# Altium schematic sheet HEATING_KAROFI.SchDoc
size A2; SheetNumber: 2; SheetTotal: 2
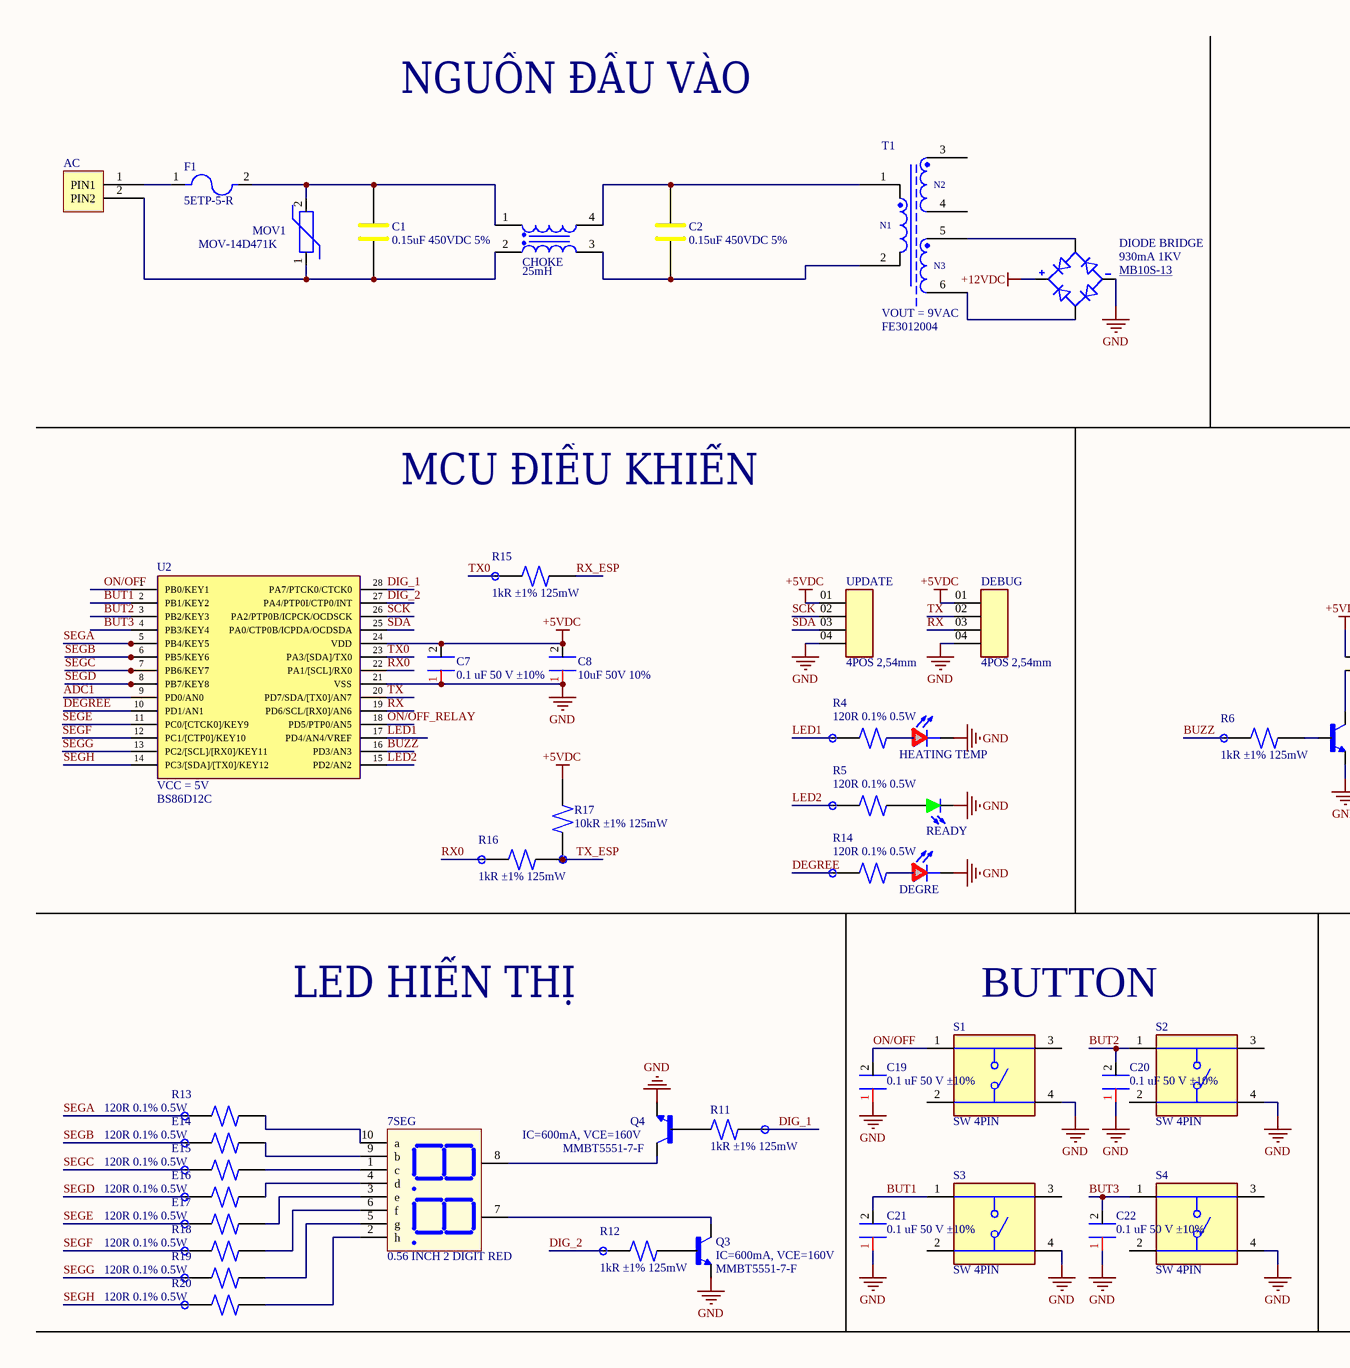
[diagram p0: HEATING_KAROFI.SchDoc, left]
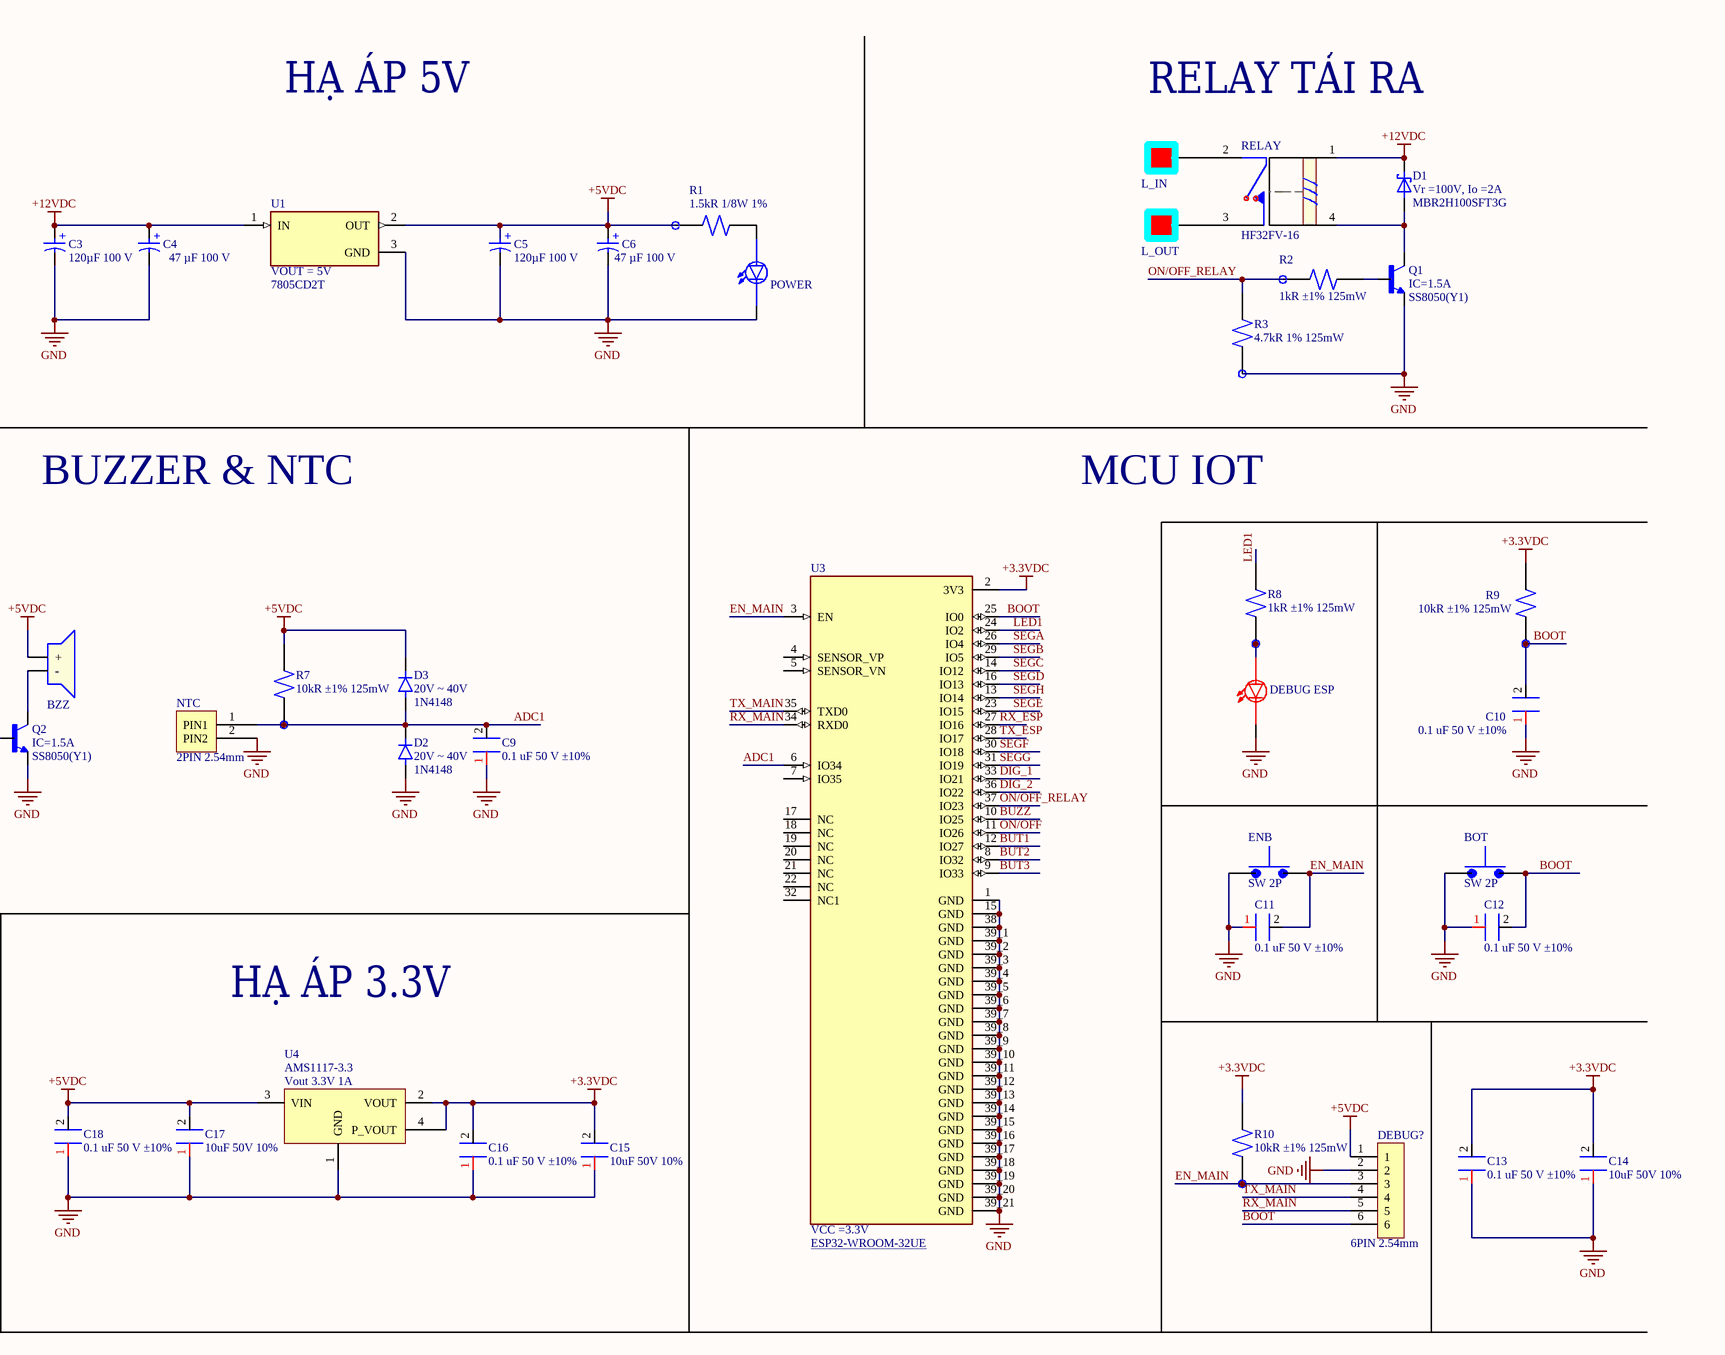
[diagram p1: HEATING_KAROFI.SchDoc, right]

## Parts
7SEG  value 0.56 INCH 2 DIGIT RED  [7SEG_K_2SO]  (hidden comment: CS5621A)
AC  2PIN 5.08mm  [HEADER_5.08mm]  (value not drawn)
BOT  SW 2P  [SW_BUTT-2PIN SMD SPST]
BZZ  BUZZERS;BUZZERS,5V,2400Hz,12x9.5mm,TMB12A05  [BUZZERS_TMB12A05]  (value not drawn)
C1  0.15uF 450VDC 5%  [CAP_FILM DIP 0.1uF 15x12x4mm]
C2  0.15uF 450VDC 5%  [CAP_FILM DIP 0.1uF 15x12x4mm]
C3  120µF 100 V  [CAP-ALUM_120uF-100V]
C4  47 µF 100 V  [CAP-ALUM_47uF-100V]
C5  120µF 100 V  [CAP-ALUM_120uF-100V]
C6  47 µF 100 V  [CAP-ALUM_47uF-100V]
C7  0.1 uF 50 V ±10%  [CAP-CER_0805 SMD 2.01x1.25mm]
C8  10uF 50V 10%  [CAP-CER_0805 SMD 2.01x1.25mm]
C9  0.1 uF 50 V ±10%  [CAP-CER_0805 SMD 2.01x1.25mm]
C10  0.1 uF 50 V ±10%  [CAP-CER_0805 SMD 2.01x1.25mm]
C11  0.1 uF 50 V ±10%  [CAP-CER_0805 SMD 2.01x1.25mm]
C12  0.1 uF 50 V ±10%  [CAP-CER_0805 SMD 2.01x1.25mm]
C13  0.1 uF 50 V ±10%  [CAP-CER_0805 SMD 2.01x1.25mm]
C14  10uF 50V 10%  [CAP-CER_0805 SMD 2.01x1.25mm]
C15  10uF 50V 10%  [CAP-CER_0805 SMD 2.01x1.25mm]
C16  0.1 uF 50 V ±10%  [CAP-CER_0805 SMD 2.01x1.25mm]
C17  10uF 50V 10%  [CAP-CER_0805 SMD 2.01x1.25mm]
C18  0.1 uF 50 V ±10%  [CAP-CER_0805 SMD 2.01x1.25mm]
C19  0.1 uF 50 V ±10%  [CAP-CER_0805 SMD 2.01x1.25mm]
C20  0.1 uF 50 V ±10%  [CAP-CER_0805 SMD 2.01x1.25mm]
C21  0.1 uF 50 V ±10%  [CAP-CER_0805 SMD 2.01x1.25mm]
C22  0.1 uF 50 V ±10%  [CAP-CER_0805 SMD 2.01x1.25mm]
CHOKE  25mH  [IND-CHOKE_25mH]
D1  Vr =100V, Io =2A  Manufacturer Part Number: MBR2H100SFT3G  [DIODE-SCHOTTKY_MBR2H100SFT3G-SOD123FL]
D2  20V ~ 40V  Manufacturer Part Number: 1N4148  [DIODE-SCHOTTKY_1N4148 5x2.4x1.2mm]
D3  20V ~ 40V  Manufacturer Part Number: 1N4148  [DIODE-SCHOTTKY_1N4148 5x2.4x1.2mm]
DEBUG  4POS 2,54mm  [JUMP_4POS_TH_NO-BODY]  (no BOM)
DEBUG?  6PIN 2.54mm  [HEADER_6PIN_2.54mm_NO-BODY]  (no BOM)
DEBUG_ESP  XL-1608SURC-06  [DIODE-LED_SMD-XL-1608SURC-06 RED 1.25x1.14mm]  (value not drawn)
DEGRE  LTL17KRH5D-012A  [LED_DIP_3mm; RED]  (value not drawn)
DIODE_BRIDGE  930mA 1KV  Manufacture Part Number Cross: MB10S-13  [DIODE-BRIDGE_MB10S_SOP4]
E14  120R 0.1% 0.5W  [RES_0805 2x1.25mm]
E15  120R 0.1% 0.5W  [RES_0805 2x1.25mm]
E16  120R 0.1% 0.5W  [RES_0805 2x1.25mm]
E17  120R 0.1% 0.5W  [RES_0805 2x1.25mm]
ENB  SW 2P  [SW_BUTT-2PIN SMD SPST]
F1  5ETP-5-R  [FUSE_5A-5ETP-5-R]
HEATING_TEMP  LTL17KRH5D-012A  [LED_DIP_3mm; RED]  (value not drawn)
L_IN  TP PCB  [TERMINAL]  (value not drawn)
L_OUT  TP PCB  [TERMINAL]  (value not drawn)
MOV1  MOV-14D471K  [VAR-MOV_14D561K]
NTC  2PIN 2.54mm  [HEADER-CONN_2POS_2.54mm]
POWER  LED BLUE  [DIODE-LED_SMD-LXT0805GW-TR 1.25X1.14MM]  (value not drawn)
Q1  IC=1.5A  Manufacturer Part Number: SS8050(Y1)  [TRANS-BJT_SS8050]
Q2  IC=1.5A  Manufacturer Part Number: SS8050(Y1)  [TRANS-BJT_SS8050]
Q3  IC=600mA, VCE=160V  Manufacture Part Number Cross: MMBT5551-7-F  [TRANS-BJT_SS8050]
Q4  IC=600mA, VCE=160V  Manufacture Part Number Cross: MMBT5551-7-F  [TRANS-BJT_SS8050]
R1  1.5kR 1/8W 1%  [RES_0805 2x1.25mm]
R2  1kR ±1% 125mW  [RES_0805 2x1.25mm]
R3  4.7kR 1% 125mW  [RES_0805 2x1.25mm]
R4  120R 0.1% 0.5W  [RES_0805 2x1.25mm]
R5  120R 0.1% 0.5W  [RES_0805 2x1.25mm]
R6  1kR ±1% 125mW  [RES_0805 2x1.25mm]
R7  10kR ±1% 125mW  [RES_0805 2x1.25mm]
R8  1kR ±1% 125mW  [RES_0805 2x1.25mm]
R9  10kR ±1% 125mW  [RES_0805 2x1.25mm]
R10  10kR ±1% 125mW  [RES_0805 2x1.25mm]
R11  1kR ±1% 125mW  [RES_0805 2x1.25mm]
R12  1kR ±1% 125mW  [RES_0805 2x1.25mm]
R13  120R 0.1% 0.5W  [RES_0805 2x1.25mm]
R14  120R 0.1% 0.5W  [RES_0805 2x1.25mm]
R15  1kR ±1% 125mW  [RES_0805 2x1.25mm]
R16  1kR ±1% 125mW  [RES_0805 2x1.25mm]
R17  10kR ±1% 125mW  [RES_0805 2x1.25mm]
R18  120R 0.1% 0.5W  [RES_0805 2x1.25mm]
R19  120R 0.1% 0.5W  [RES_0805 2x1.25mm]
R20  120R 0.1% 0.5W  [RES_0805 2x1.25mm]
READY  TLLG4400  [LED_DIP_3mm; GREEN]  (value not drawn)
RELAY  HF32FV-16  [RELAY 16A 4PIN]
S1  SW 4PIN  [SW_BUTT-4PIN-PLASTIC]
S2  SW 4PIN  [SW_BUTT-4PIN-PLASTIC]
S3  SW 4PIN  [SW_BUTT-4PIN-PLASTIC]
S4  SW 4PIN  [SW_BUTT-4PIN-PLASTIC]
T1  VOUT = 9VAC  Manufacturer Part Number: FE3012004  [FE3012-004]
U1  VOUT = 5V  Manufacture Part Number Cross: 7805CD2T  [IC_7805-TO220-3]
U2  VCC = 5V  Manufacture Cross: BS86D12C  [MCU-BS86D12C_SOP-28]
U3  VCC =3.3V  Manufacturer Part Number: ESP32-WROOM-32UE  [MCU_ESP32-WROOM-32UE]
U4  Vout 3.3V 1A  Manufacturer part Number: AMS1117-3.3  [IC_AMS1117-3.3V]
UPDATE  4POS 2,54mm  [JUMP_4POS_TH_NO-BODY]  (no BOM)

## Nets
+3.3VDC: C13.2 C14.2 C15.2 C16.2 R9.2 R10.2 U3.2(3V3) U4.2(VOUT) U4.4(P_VOUT)
+5VDC: BZZ.1(+) C5.1 C6.1 C7.2 C8.2 C17.2 C18.2 D3.K DEBUG.01 DEBUG?.1 R1.1 R7.2 R17.2 U1.2(OUT) U2.24(VDD) U4.3(VIN) UPDATE.01
+12VDC: C3.1 C4.1 D1.C DIODE_BRIDGE.1(POS) RELAY.1 U1.1(IN)
GND: BOT.1 C3.2 C4.2 C5.2 C6.2 C7.1 C8.1 C9.1 C10.1 C11.1 C12.1 C13.1 C14.1 C15.1 C16.1 C17.1 C18.1 C19.1 C20.1 C21.1 C22.1 D2.A DEBUG.04 DEBUG?.2 DEBUG_ESP.C DEGRE.2(C) DIODE_BRIDGE.2(NEG) ENB.1 HEATING_TEMP.2(C) NTC.2(PIN2) POWER.C Q1.2(E) Q2.2(E) Q3.2(E) Q4.2(E) R3.1 READY.K(C) S1.4 S2.4 S3.4 S4.4 U1.3(GND) U2.21(VSS) U3.1(GND) U3.15(GND) U3.38(GND) U3.39_1(GND) U3.39_2(GND) U3.39_3(GND) U3.39_4(GND) U3.39_5(GND) U3.39_6(GND) U3.39_7(GND) U3.39_8(GND) U3.39_9(GND) U3.39_10(GND) U3.39_11(GND) U3.39_12(GND) U3.39_13(GND) U3.39_14(GND) U3.39_15(GND) U3.39_16(GND) U3.39_17(GND) U3.39_18(GND) U3.39_19(GND) U3.39_20(GND) U3.39_21(GND) U4.1(GND) UPDATE.04
ADC1: C9.2 D2.K D3.A NTC.1(PIN1) R7.1 U2.9(PD0/AN0) U3.6(IO34)
BOOT: BOT.2 C10.2 C12.2 DEBUG?.6 R9.1 U3.25(IO0)
BUT1: C21.2 S3.1 U2.2(PB1/KEY2) U3.12(IO27)
BUT2: C20.2 S2.1 U2.3(PB2/KEY3) U3.8(IO32)
BUT3: C22.2 S4.1 U2.4(PB3/KEY4) U3.9(IO33)
BUZZ: R6.1 U2.16(PD3/AN3) U3.10(IO25)
DEGREE: R14.1 U2.10(PD1/AN1)
DIG_1: R11.1 U2.28(PA7/PTCK0/CTCK0) U3.33(IO21)
DIG_2: R12.1 U2.27(PA4/PTP0I/CTP0/INT) U3.36(IO22)
EN_MAIN: C11.2 DEBUG?.3 ENB.2 R10.1 U3.3(EN)
LED1: R4.1 R8.2 U2.17(PD4/AN4/VREF) U3.24(IO2)
LED2: R5.1 U2.15(PD2/AN2)
ON/OFF: C19.2 S1.1 U2.1(PB0/KEY1) U3.11(IO26)
ON/OFF_RELAY: R2.1 R3.2 U2.18(PD5/PTP0/AN5) U3.37(IO23)
RX: DEBUG.03 U2.19(PD6/SCL/[RX0]/AN6)
RX0: R16.1 U2.22(PA1/[SCL]/RX0)
RX_ESP: R15.2 U3.27(IO16)
RX_MAIN: DEBUG?.5 U3.34(RXD0)
SCK: U2.26(PA2/PTP0B/ICPCK/OCDSCK) UPDATE.02
SDA: U2.25(PA0/CTP0B/ICPDA/OCDSDA) UPDATE.03
SEGA: R13.1 U2.5(PB4/KEY5) U3.26(IO4)
SEGB: E14.1 U2.6(PB5/KEY6) U3.29(IO5)
SEGC: E15.1 U2.7(PB6/KEY7) U3.14(IO12)
SEGD: E16.1 U2.8(PB7/KEY8) U3.16(IO13)
SEGE: E17.1 U2.11(PC0/[CTCK0]/KEY9) U3.23(IO15)
SEGF: R18.1 U2.12(PC1/[CTP0]/KEY10) U3.30(IO18)
SEGG: R19.1 U2.13(PC2/[SCL]/[RX0]/KEY11) U3.31(IO19)
SEGH: R20.1 U2.14(PC3/[SDA]/[TX0]/KEY12) U3.13(IO14)
TX: DEBUG.02 U2.20(PD7/SDA/[TX0]/AN7)
TX0: R15.1 U2.23(PA3/[SDA]/TX0)
TX_ESP: R16.2 R17.1 U3.28(IO17)
TX_MAIN: DEBUG?.4 U3.35(TXD0)
Net7SEG_1: 7SEG.1(c) E15.2
Net7SEG_2: 7SEG.2(h) R20.2
Net7SEG_3: 7SEG.3(e) E17.2
Net7SEG_4: 7SEG.4(d) E16.2
Net7SEG_5: 7SEG.5(g) R19.2
Net7SEG_6: 7SEG.6(f) R18.2
Net7SEG_7: 7SEG.7(L2) Q3.3(C)
Net7SEG_8: 7SEG.8(Vcc) Q4.3(C)
Net7SEG_9: 7SEG.9(b) E14.2
Net7SEG_10: 7SEG.10(a) R13.2
NetAC_1: AC.1(PIN1) F1.1
NetAC_2: AC.2(PIN2) C1.1 CHOKE.2 MOV1.1
NetBZZ_2: BZZ.2(-) Q2.3(C)
NetC1_2: C1.2 CHOKE.1 F1.2 MOV1.2
NetC2_1: C2.1 CHOKE.3 T1.2
NetC2_2: C2.2 CHOKE.4 T1.1
NetD1_A: D1.A Q1.3(C) RELAY.4
NetDEBUG_ESP_A: DEBUG_ESP.A R8.1
NetDEGRE_1: DEGRE.1(A) R14.2
NetDIODE_BRIDGE_3: DIODE_BRIDGE.3(AC2) T1.6
NetDIODE_BRIDGE_4: DIODE_BRIDGE.4(AC1) T1.5
NetHEATING_TEMP_1: HEATING_TEMP.1(A) R4.2
NetL_IN_1: L_IN.1 RELAY.2
NetL_OUT_1: L_OUT.1 RELAY.3
NetPOWER_A: POWER.A R1.2
NetQ1_1: Q1.1(B) R2.2
NetQ2_1: Q2.1(B) R6.2
NetQ3_1: Q3.1(B) R12.2
NetQ4_1: Q4.1(B) R11.2
NetR5_2: R5.2 READY.A

Not connected (* = marked no-connect by the designer): S1 2 3; S2 2 3; S3 2 3; S4 2 3; T1 3 4; U3 4(SENSOR_VP) 5(SENSOR_VN) 7(IO35) 17(NC) 18(NC) 19(NC) 20(NC) 21(NC) 22(NC) 32(NC1)

## Notes on the sheet
- NGUỒN ĐẦU VÀO
- HẠ ÁP 5V
- RELAY TẢI RA
- MCU ĐIỀU KHIỂN
- BUZZER & NTC
- MCU IOT
- LED HIỂN THỊ
- BUTTON
- HẠ ÁP 3.3V
- Lần
- Nội dung thay đổi
- Ngày
- Vật liệu:
- Khối lượng:
- Số lượng:
- Sheet:
- Tên bản vẽ:
- Mã LK bản vẽ:
- Thiết kế
- Kiểm tra
- Phê duyệt
- Tên sản phẩm:
- Đơn vị
- Mã sản phẩm:
- Phiên bản
- Tỷ lệ
- Trang
- MINH REUS
- (in symbol CAP_ALUM;47UF 20% 100V;TH) +
- (in symbol CAP_ALUM;120uF 20% 100V;TH) +
- (in symbol PCB_TRANSFORMER;6P TH;) N2; N1; N3

## Library data of the parts
7SEG = SEVEN_LED_DIP, 0.56INCH, K-COMOM, RED, 2 DIGIT: SEVEN_LED_DIP, 0.56INCH, K-COMOM, RED, 2 DIGIT;CS5621A; Manufacturer: CHANCE  ELECTRONIC; Manufacture Cross: Broadcom / Avago; Manufacture Part Number Cross: HDSP-521E; Library Make By: Minh Reus; Manufacturer Part Number: CS5621A; Link: http://www.smggc.com/page5?product_id=28; ComponentLink1Description: Link Cross; ComponentLink1URL: https://www.mouser.com/ProductDetail/Broadcom-Avago/HDSP-521E?qs=pQfy5%252BKCabIW5pTqWifotQ%3D%3D; ComponentLink2Description: Link Original; ComponentLink2URL: https://www.mouser.com/ProductDetail/Broadcom-Avago/HDSP-521E?qs=pQfy5%252BKCabIW5pTqWifotQ%3D%3D; ComponentLink3Description: Link Datasheet; ComponentLink3URL: https://www.mouser.com/datasheet/2/678/AV02_3586EN_2024_06_27-1828384.pdf; Package: TH; Price: 0.96 USD
AC = HEADER_2PIN;TH;5.08mm: Headers & Wire Housings 2 CKT 5.08MM KK HDR; Manufacturer: Molex; Link in VN: NA; Values: 2PIN 2.5 mm; Library Make By: Minh Reus; Manufacturer Part Number: 10-08-1022; Link: https://www.xonelec.com/mpn/xkb/x8821wvs029tsn; Package: TH; Manufacture Cross: Molex; Manufacture Part Number Cross: 10-08-1022; Price: 0.195 USD; ComponentLink1Description: Link Datasheet; ComponentLink1URL: https://www.molex.com/en-us/products/part-detail/10081022?display=pdf; ComponentLink2Description: Link Cross; ComponentLink2URL: https://www.mouser.com/ProductDetail/Molex/10-08-1022?qs=zPGVQsJz0CCM8qNbb3Gz6w%3D%3D; ComponentLink3Description: Link Original; ComponentLink3URL: https://www.mouser.com/ProductDetail/Molex/10-08-1022?qs=zPGVQsJz0CCM8qNbb3Gz6w%3D%3D
BOT ENB = SWITCH_BUTTON ;SMD;: Tactile Switches 3.9x2.9x2.0mm 160gf Packaging Temp 60oC; Manufacturer: Alps Alpine; Manufacture Part Number: SKRKAEE010; Value: NA; Library Make By: Minh Reus; Link: https://www.snapeda.com/parts/SKRPABE010/ALPS/view-part/?ref=snap; Package: None; Price: https://www.snapeda.com/parts/SKRPABE010/ALPS/view-part/?ref=eda; Manufacture Cross: Alps Alpine; Manufacture Part Number Cross: SKRKAEE010; ComponentLink1Description: Link Datasheet; ComponentLink1URL: https://www.mouser.vn/datasheet/2/15/SKRK-1110686.pdf; ComponentLink2Description: Link Original; ComponentLink2URL: https://www.mouser.vn/ProductDetail/Alps-Alpine/SKRKAEE010?qs=haWY0xvQGj%252BcIYZCNiEMZg%3D%3D; ComponentLink3Description: Link Cross; ComponentLink3URL: https://www.mouser.vn/ProductDetail/Alps-Alpine/SKRKAEE010?qs=haWY0xvQGj%252BcIYZCNiEMZg%3D%3D
BZZ = BUZZERS;BUZZERS,5V,2400Hz,12x9.5mm,TMB12A05: Manufacturer: YUEXIN; Current: 30mA; Name: BUZZERS_TMB12A05; Link: https://www.lcsc.com/product-detail/Buzzers_YUEXIN-TMB12A05_C781860.html; Price: non-available; Value: 5V; Temperature: 30℃~+85℃; Package: TH; Manufacturer Part Number: TMB12A05; ComponentLink1Description: Link Datasheet; ComponentLink1URL: https://www.lcsc.com/datasheet/lcsc_datasheet_2304140030_YUEXIN-TMB12A05_C781860.pdf; ComponentLink2Description: Link Cross; ComponentLink2URL: https://www.lcsc.com/product-detail/Buzzers_YUEXIN-TMB12A05_C781860.html; ComponentLink3Description: Link Original; ComponentLink3URL: https://www.lcsc.com/product-detail/Buzzers_YUEXIN-TMB12A05_C781860.html; Manufacture Cross: YUEXIN; Manufacture Part Number Cross: TMB12A05
C1 C2 = CAP_FILM;TH;0.15uF 450VDC 5%;: CAR FILM Polypropylene Film Capacitor ;TH; 0.1uF 275V ECW-FE2W154JA; Manufacturer: Panasonic Electronic Components; Library Make By: Minh Reus; Manufacturer Part Number: ECW-FE2W154JA; Manufacture Cross: Panasonic Electronic Components; Manufacture Part Number Cross: ECW-FE2W154JA; Link: https://www.digikey.com/en/products/detail/panasonic-electronic-components/ECW-FE2W154JA/5880948; Package: TH; Value: 0.15uF 450VDC 5%; ComponentLink1Description: Link Original; ComponentLink1URL: https://www.digikey.com/en/products/detail/panasonic-electronic-components/ECW-FE2W154JA/5880948; ComponentLink2Description: Link Cross; ComponentLink2URL: https://www.mouser.vn/ProductDetail/Panasonic/ECW-FE2W154JA?qs=wYonFgBYHKnr31EZHmFN1Q%3D%3D; ComponentLink3Description: Link Datasheet; ComponentLink3URL: https://www.mouser.vn/datasheet/2/315/ABD0000C202-947675.pdf; Price: 0.20847 USD
C3 C5 = CAP_ALUM;120uF 20% 100V;TH: 120 µF 100 V Aluminum Electrolytic Capacitors Radial, Can 10000 Hrs @ 105°C; Manufacturer Part Number: EEU-FS2A121; Manufacturer: Panasonic Electronic Components; Library Make By: Minh Reus; ComponentLink1Description: Link Original; ComponentLink1URL: https://www.digikey.in/en/products/detail/panasonic-electronic-components/EEU-FS2A121/9597032; ComponentLink2Description: Datasheet Link; ComponentLink2URL: https://www.digikey.in/en/products/detail/panasonic-electronic-components/EEU-FS2A121/9597032; Packaging: TH; Value: 120µF 100 V; Manufacture Cross: Panasonic Electronic Components; Manufacture Part Number Cross: EEU-FS2A121; Link: https://www.digikey.in/en/products/detail/panasonic-electronic-components/EEU-FS2A121/9597032; Price: 0.093 USD; ComponentLink3Description: Link Cross; ComponentLink3URL: https://www.digikey.in/en/products/detail/panasonic-electronic-components/EEU-FS2A121/9597032
C4 C6 = CAP_ALUM;47UF 20% 100V;TH: 47 µF 100 V Aluminum Electrolytic Capacitors Radial, Can 6000 Hrs @ 105°C; Manufacturer Part Number: EEU-FS2A470; Manufacturer: Panasonic Electronic Components; Library Make By: Minh Reus; ComponentLink1Description: Link Original; ComponentLink1URL: https://www.digikey.com/en/products/detail/panasonic-electronic-components/EEU-FS2A470/9597028; ComponentLink2Description: Datasheet Link; ComponentLink2URL: https://www.digikey.com/en/products/detail/panasonic-electronic-components/EEU-FS2A470/9597028; Packaging: TH; Value: 47 µF 100 V; Manufacture Cross: Panasonic Electronic Components; Manufacture Part Number Cross: EEU-FS2A470; Link: https://www.digikey.com/en/products/detail/panasonic-electronic-components/EEU-FS2A470/9597028; Price: 0.093 USD; ComponentLink3Description: Link Cross; ComponentLink3URL: https://www.digikey.com/en/products/detail/panasonic-electronic-components/EEU-FS2A470/9597028
C7 C9-C13 C16 C18-C22 = CAP_CER; SMD; 0.1uF 50V ±10%;0805;: Multilayer Ceramic Capacitor, 0.1 uF, 50 V, ± 10%, X7R, 0805 [2012 Metric]; Manufacturer: Kyocera AVX; Manufacturer Part Number: 08055C104K4T4A; Manufacture Cross: Vishay; Manufacture Part Number Cross: VJ0805Y104KBABE31; Library Make By: Minh Reus; Price: 0.0241 USD; Package: 0805; Value: 0.1uF 50V 10%; ComponentLink1URL: https://datasheet.ciiva.com/26904/getdatasheetpartid-74229-26904224.pdf?src-supplier=Verical; ComponentLink1Description: Link Datasheet; ComponentLink2URL: https://www.digikey.com/en/products/detail/kyocera-avx/08055C104K4T4A/1602855; ComponentLink2Description: Link Original; ComponentLink3URL: https://www.mouser.vn/ProductDetail/Vishay-Vitramon/VJ0805Y104KBABE31?qs=TLaLXeh6c70yB%252BsdRZoYCQ%3D%3D; ComponentLink3Description: Link Cross; Link: https://www.digikey.com/en/products/detail/kyocera-avx/08055C104K4T4A/1602855
C8 C14 C15 C17 = CAP_CER;10uF 50V 10%;SMD;0805: Ceramic Capacitor, Multilayer, Ceramic, 50V, 10% +Tol, 10% -Tol, X5R, 10uF, Surface Mount, 0805; Manufacturer: Murata; Manufacturer Part Number: GRM21BR61H106KE43K; Manufacture Cross: SANYEAR; Manufacture Part Number Cross: C0805X5R106K500NT; Library Make By: Minh Reus; Package: 0805; Value: 10uF 50V 10%; ComponentLink1URL: https://datasheet.octopart.com/GRM21BR61H106KE43K-Murata-datasheet-155239205.pdf?src-supplier=Newark; ComponentLink1Description: Link Datasheet; ComponentLink2URL: https://www.lcsc.com/product-detail/Multilayer-Ceramic-Capacitors-MLCC-SMD-SMT_SANYEAR-C0805X5R106K500NT_C962154.html; ComponentLink2Description: Link Cross; ComponentLink3URL: https://www.digikey.com/en/products/detail/murata-electronics/GRM21BR61H106KE43K/15191954; ComponentLink3Description: Link Original; Price: 0.0679 USD; Link: https://www.digikey.com/en/products/detail/murata-electronics/GRM21BR61H106KE43K/15191954
CHOKE = INDUCTOR_CHOKE;TH;25mH: WE-TFC THT Common Mode Power Line Choke, UU9.8V, 25mH, 0.25A, 3.6Ω; Manufacturer Part Number: 744862250; Value: 25 mH 10 kHz; ComponentLink1Description: Link Cross; ComponentLink1URL: https://www.we-online.com/redexpert/article/744862250?ad; ComponentLink2Description: Link Datasheet; ComponentLink2URL: https://www.we-online.com/redexpert/spec/744862250?ad; Manufacture Cross: WE-TFC; Manufacture Part Number Cross: 744862250; Manufacturer: WE-TFC; Price: 2.2 USD; Link: https://www.digikey.com/en/products/detail/w%C3%BCrth-elektronik/744862250/2626083; Packaging: Through Hole; ComponentLink3Description: Link Original; ComponentLink3URL: https://www.digikey.com/en/products/detail/w%C3%BCrth-elektronik/744862250/2626083
D1 = DIODE_SCHOTTKY;SMD;SOD-123FL;2A: Diode Schottky 100V 2A Surface Mount SOD-123FL; Manufacturer: ON Semiconductor; Manufacture Cross: Diodes Incorporated; Manufacture Part Number Cross: B2100-13-F; Value: NA; Library Make By: Minh Reus; Package: SOD-123 ON Semiconductor; Link: https://www.digikey.com/en/products/detail/onsemi/MBR2H100SFT3G/2194005; Price: 0.13994 USD; ComponentLink1Description: Link Datasheet; ComponentLink1URL: https://www.diodes.com/assets/Datasheets/ds30021.pdf; ComponentLink2Description: Link Original; ComponentLink2URL: https://www.digikey.com/en/products/detail/onsemi/MBR2H100SFT3G/2194005; ComponentLink3Description: Link Cross; ComponentLink3URL: https://www.digikey.com/en/products/detail/diodes-incorporated/B2100-13-F/814957
D2 D3 = DIODE_SCHOTTKY; SMD;: DIODE SCHOTTKY; SMD; VCC 20V-->40V; Manufacturer: CHENMKO ENTERPRISE; Manufacture Cross: Vishay Semiconductors; Manufacture Part Number Cross: BAT54WS-HE3-08; Library Make By: Minh Reus; Link: https://www.digchip.net/datasheets/parts/datasheet/882/LL340PT.php; Link in VN: https://linhkienchatluong.vn/diode-chinh-luu/diode-1n4148-sot-80-smd-loai-thuong-day-500c_sp572_ct8027.aspx; Package: SOT-80; Value: 20V ~ 40V; ComponentLink1Description: Link Datasheet; ComponentLink1URL: https://www.vishay.com/docs/85667/bat54ws.pdf; ComponentLink2Description: Link Cross; ComponentLink2URL: https://www.mouser.vn/ProductDetail/Vishay-Semiconductors/BAT54WS-HE3-08?qs=ESFF34Uzhwit1TO6n98Cjg%3D%3D&mgh=1&utm_id=21163026226&gad_source=1&gclid=Cj0KCQjwq_G1BhCSARIsACc7Nxq-ByYxpFlbPIIvX67EumUAu1MSEoCGJu52P8TCuTLh4yWmNT1_8AoaAmsOEALw_wcB; ComponentLink3Description: Link Original; ComponentLink3URL: https://www.digchip.net/datasheets/parts/datasheet/882/LL340PT.php; Price: 0.051 USD
DEBUG UPDATE = JUMP_4POS;TH;2.54;NO-BODY: CONN HEADER VERT 4POS 2.54MM; Manufacture: Samtec; Manufacture Part Number: HMTSW-104-08-S-S-280; Manufacture Part Number Cross: HMTSW-104-08-G-S-250; Value: NA; Library Make By: Minh Reus; Link: https://www.snapeda.com/parts/HMTSW-104-08-S-S-280/Samtec/view-part/?ref=snap; Package: TH; Manufacture Cross: Samtec; Price: 1.06 USD; ComponentLink1Description: Link Datasheet; ComponentLink1URL: https://www.digikey.com/en/products/detail/samtec-inc/HMTSW-104-08-G-S-250/8450805; ComponentLink2Description: Link Cross; ComponentLink2URL: https://www.digikey.com/en/products/detail/samtec-inc/HMTSW-104-08-G-S-250/8450805; ComponentLink3Description: Link Original; ComponentLink3URL: https://www.digikey.com/en/products/detail/samtec-inc/HMTSW-104-08-G-S-250/8450805
DEBUG? = HEADER_6PIN;TH;6PIN 2.54mm;NO-BODY: 6 Position Elevated Socket Connector 0.100" (2.54mm) Through Hole Gold; Manufacture: SAMTEC; Manufacture Part Number: ESQ-106-59-G-S; Value: NA; Library Make By: Minh Reus; Price: 2.71 USD; Link: https://www.digikey.com/en/products/detail/samtec-inc/ESQ-106-59-G-S/7097334; Package: TH; Manufacture Cross: SAMTEC; Manufacture Part Number Cross: ESQ-106-59-G-S; ComponentLink1Description: Link Datasheet; ComponentLink1URL: https://suddendocs.samtec.com/catalog_english/esq_th.pdf; ComponentLink2Description: Link Cross; ComponentLink2URL: https://www.digikey.com/en/products/detail/samtec-inc/ESQ-106-59-G-S/7097334; ComponentLink3Description: Link Original; ComponentLink3URL: https://www.digikey.com/en/products/detail/samtec-inc/ESQ-106-59-G-S/7097334
DEBUG_ESP = DIODE_LED;SMD;RED COLOUR: DIODE_LED;SMD;RED COLOUR; XL-1608SURC-06; / 25mA ; -30℃~+85℃ Positive post 617nm~621nm Red 120° 55mW 0805 Light Emitting Diodes (LED) ROHS; Manufacturer: XINGLIGHT; Manufacture Cross: Würth Elektronik; Manufacture Part Number Cross: 150080BS75000; Values: NA; Library Make By: Minh Reus; Manufacturer Part Number: XL-1608SURC-06; Link: https://www.lcsc.com/product-detail/Light-Emitting-Diodes-LED_XINGLIGHT-XL-1608SURC-06_C965799.html; Link in VN: NA; Package: SMD 0805; Price: 0.131 USD; ComponentLink1Description: New link; ComponentLink1URL: *; ComponentLink2Description: New link; ComponentLink2URL: *; ComponentLink3Description: New link; ComponentLink3URL: *
DEGRE HEATING_TEMP = LED_SINGLE_DIP; RED; 3mm_1: LED_SINGLE_DIP; RED; 3mm; Package: 3mm; Price: None; Value: *; Manufacturer Part Number: LTL17KRH5D-012A; Link: https://www.lcsc.com/product-detail/Light-Emitting-Diodes-span-style-background-color-ff0-LED-span_Lite-On-LTL17KRH5D-012A_C7435538.html
DIODE_BRIDGE = DIODE_BRIDGE;SMD;1KV 930mA: Bridge Rectifier Single Phase Standard 1 kV Surface Mount 4-SOIC; Manufacturer: ON Semiconductor; Manufacture Cross: Diodes Incorporated; Manufacturer Part Number: MB10S; Library Make By: Minh Reus; Value: 930mA 1kV; Price: 0.098 USD; Package: SOIC W-4 ON Semiconductor; Link: https://www.mouser.vn/ProductDetail/Diodes-Incorporated/MB10S-13?qs=5aG0NVq1C4wPZ2Ttiq0ONw%3D%3D&utm_id=10891671065&gad_source=1&gclid=Cj0KCQjwzva1BhD3ARIsADQuPnUE4S6tFXpZKEunPRtKt-VN8q0pn3n1xgvXIpo0Gd4DdVGxs75Bb50aAn4MEALw_wcB; ComponentLink1Description: Link Datasheet; ComponentLink1URL: https://www.mouser.vn/datasheet/2/115/DIOD_S_A0003097176_1-2542130.pdf; ComponentLink2Description: Link Cross; ComponentLink2URL: https://www.mouser.vn/ProductDetail/Diodes-Incorporated/MB10S-13?qs=5aG0NVq1C4wPZ2Ttiq0ONw%3D%3D&utm_id=10891671065&gad_source=1&gclid=Cj0KCQjwzva1BhD3ARIsADQuPnUE4S6tFXpZKEunPRtKt-VN8q0pn3n1xgvXIpo0Gd4DdVGxs75Bb50aAn4MEALw_wcB; ComponentLink3Description: Link Original; ComponentLink3URL: https://www.mouser.vn/ProductDetail/Diodes-Incorporated/MB10S-13?qs=5aG0NVq1C4wPZ2Ttiq0ONw%3D%3D&utm_id=10891671065&gad_source=1&gclid=Cj0KCQjwzva1BhD3ARIsADQuPnUE4S6tFXpZKEunPRtKt-VN8q0pn3n1xgvXIpo0Gd4DdVGxs75Bb50aAn4MEALw_wcB
E14-E17 R4 R5 R13 R14 R18-R20 = RES; SMD; 120R 0.1% 0.5W;0805: Thick Film Resistors 0805 120ohms 0.5W 0.5% AEC-Q200; Manufacturer Part Number: ERJ-P06D1200V; Manufacturer: Panasonic; Value: 120R 0.1% 1/10W; Library Make By: Minh Reus; Link: https://www.mouser.com/ProductDetail/Panasonic/ERJ-P06D1200V?qs=sGAEpiMZZMvdGkrng054tzSGWtpoOZZIMqKhr0RuMnQ%3D; Package: 0805; Manufacture Part Number Cross: ERJ-P06D1200V; Manufacture Cross: Panasonic; Price: 0.0333 USD; ComponentLink1Description: Link Cross; ComponentLink1URL: https://www.mouser.com/datasheet/2/315/AOA0000C331-1141874.pdf; ComponentLink2Description: Link Original; ComponentLink2URL: https://www.mouser.com/ProductDetail/Panasonic/ERJ-P06D1200V?qs=sGAEpiMZZMvdGkrng054tzSGWtpoOZZIMqKhr0RuMnQ%3D; ComponentLink3Description: Link Datasheet; ComponentLink3URL: https://www.mouser.com/ProductDetail/Panasonic/ERJ-P06D1200V?qs=sGAEpiMZZMvdGkrng054tzSGWtpoOZZIMqKhr0RuMnQ%3D
F1 = FUSE;TH;5A: FUSE;TH;5A;5ETP 1-R (0655R1000-13) | Glass Tube Fuse | 5x20mm | IEC Low Break | Time Lag | High Surge | 1A; Manufacturer: BEL FUSE; Library Make By: Minh Reus; Package: DIP; Value: 5A; Manufacturer Part Number: 5ETP-5-R; Link: https://www.digikey.com/en/products/detail/bel-fuse-inc/5ETP-5-R/2257992; Manufacture Cross: BEL FUSE; Manufacture Part Number Cross: 5ETP-5-R; Price: 0.292 USD; ComponentLink1Description: Link Datasheet; ComponentLink1URL: https://www.mouser.vn/datasheet/2/643/ds_CP_5et_5etp_series-1313106.pdf; ComponentLink2Description: Link Cross; ComponentLink2URL: https://www.mouser.vn/ProductDetail/Bel-Fuse/5ETP-5-R?qs=MvPYbBWWJysDCsdsmDMC5w%3D%3D&srsltid=AfmBOopbcfA4DgRyLok976fAHN5m2cGoLzSHNjZ65nxq0BfdXqxbc4a9; ComponentLink3Description: Link Original; ComponentLink3URL: https://www.mouser.vn/ProductDetail/Bel-Fuse/5ETP-5-R?qs=MvPYbBWWJysDCsdsmDMC5w%3D%3D&srsltid=AfmBOopbcfA4DgRyLok976fAHN5m2cGoLzSHNjZ65nxq0BfdXqxbc4a9
L_IN L_OUT = TERMINAL 220VAC;TH: Plugin PCB Welding Terminal ROHS; Manufacturer: TE Connectivity; Manufacturer Part Number: 63862-1; Value: NA; Manufacture Cross: TE Connectivity; Manufacture Part Number Cross: 63862-1; Link: https://www.lcsc.com/product-detail/PCB-Welding-Terminal_TE-Connectivity-63862-1_C573777.html; Price: 0.01 USD; Package: TH; Library Make By: NA; ComponentLink1Description: Link Cross; ComponentLink1URL: https://www.lcsc.com/product-detail/PCB-Welding-Terminal_TE-Connectivity-63862-1_C573777.html; ComponentLink2Description: Link Original; ComponentLink2URL: https://www.lcsc.com/product-detail/PCB-Welding-Terminal_TE-Connectivity-63862-1_C573777.html; ComponentLink3Description: Link Datasheet; ComponentLink3URL: https://www.lcsc.com/product-detail/PCB-Welding-Terminal_TE-Connectivity-63862-1_C573777.html
MOV1 = VAR_MOV;DIP;14D471K: 561kV 4.5 kA Varistor 1 Circuit Through; -55° C to + 125° C; Manufacturer Part Number: MOV-14D561K; Manufacturer: Bourns; Library Make By: Minh Reus; Package: Disc-14 Bourns; Link: https://www.mouser.vn/ProductDetail/Bourns/MOV-14D561K?qs=CQ3B1E%252BbPs3fNJrywqtkng%3D%3D; Value: 561kV 4.5 kA; Manufacture Cross: Bourns; Manufacture Part Number Cross: MOV-14D561K; Price: 0.119 USD; ComponentLink1Description: Link Datasheet; ComponentLink1URL: https://www.mouser.vn/datasheet/2/54/mov14d-777765.pdf; ComponentLink2Description: Link Original; ComponentLink2URL: https://www.mouser.vn/ProductDetail/Bourns/MOV-14D561K?qs=CQ3B1E%252BbPs3fNJrywqtkng%3D%3D; ComponentLink3Description: Link Cross; ComponentLink3URL: https://www.mouser.vn/ProductDetail/Bourns/MOV-14D561K?qs=CQ3B1E%252BbPs3fNJrywqtkng%3D%3D
NTC = HEADER 2 PIN;TH;2.54mm: CONN HEADER VERT 2POS 2.5MM; Manufacturer Part Number: JST Sales America Inc.; Manufacturer: B2B-XH-A; Link in VN: NA; Library Make By: Minh Reus; Link: https://www.digikey.com/en/products/detail/jst-sales-america-inc/B2B-XH-A/1651045; Package: TH; Values: 2PIN 2.54mm; Manufacture Cross: JST Sales America Inc.; Manufacture Part Number Cross: B2B-XH-A; Price: 0.054 USD; ComponentLink1Description: Link Datasheet; ComponentLink1URL: https://www.jst-mfg.com/product/pdf/eng/eXH.pdf; ComponentLink2Description: Link Cross; ComponentLink2URL: https://www.digikey.com/en/products/detail/jst-sales-america-inc/B2B-XH-A/1651045; ComponentLink3Description: Link Original; ComponentLink3URL: https://www.digikey.com/en/products/detail/jst-sales-america-inc/B2B-XH-A/1651045
POWER = DIODE_LED;SMD; BLUE COLOR: DIODE_LED;SMD;SML-LXT0805GW-TR;Blue LED Indication - Discrete 2V 0805 _2012 Metric_; Manufacturer Part Number: Dialight; Manufacture Cross: Würth Elektronik; Manufacture Part Number Cross: 150080BS75000; Value: NA; Library Make By: Minh Reus; Link: https://www.digikey.com/en/products/detail/dialight/5988191107F/1291280?s=N4IgTCBcDaIKwE4AcBaJBGB6XoAwHYAxEAXQF8g; Package: 0805; Manufacturer: SML-LXT0805GW-TR; Price: 0.131 USD; ComponentLink1Description: Link Original; ComponentLink1URL: https://www.digikey.com/en/products/detail/dialight/5988191107F/1291280?s=N4IgTCBcDaIKwE4AcBaJBGB6XoAwHYAxEAXQF8g; ComponentLink2Description: Link Datasheet; ComponentLink2URL: https://www.we-online.com/components/products/datasheet/150080BS75000.pdf; ComponentLink3Description: Link Cross; ComponentLink3URL: https://www.digikey.com/en/products/detail/w%C3%BCrth-elektronik/150080BS75000/4489912
Q1 Q2 = TRANSISTOR NPN; SMD;: TRANSISTOR NPN; SMD; VCEmax = 25V; ICmax = 1.5A;T = 25℃; P = 0.6W;PACKAGE SOT-23; Manufacturer: JUXING; Manufacture Part Number Cross: SS8050-G; Manufacture Cross: Comchip Technology; Library Make By: Minh Reus; Link: https://www.lcsc.com/product-detail/Bipolar-Transistors-BJT_JUXING-SS8050-Y1_C5365361.html; Link in VN: https://linhkien.cxt.vn/7597-ss8050-y1-npn-transistor-15a-40v-sot-23-3.html/page-4; Package: SOT 23; Value: IC=1.5A; ComponentLink1Description: Link Datasheet; ComponentLink1URL: https://www.comchiptech.com/admin/files/product/SS8050-G%20RevA181526.pdf; ComponentLink2Description: Link Original; ComponentLink2URL: https://www.digikey.com/en/products/detail/comchip-technology/SS8050-G/6138901; ComponentLink3Description: Link Cross; ComponentLink3URL: https://www.lcsc.com/product-detail/Bipolar-Transistors-BJT_JUXING-SS8050-Y1_C5365361.html; Price: 0.056 USD
Q3 Q4 = TRANS_BJT;SMD;SOT23-3;NPN;G1: TRANS_BJT;SMD;SOT23-3 / Bipolar Transistors - BJT SS NPN 300mW; Manufacturer: Diodes Incorporated; Library Make By: Minh Reus; Value: IC=600mA, VCE=160V, VEB=6V,; Manufacturer Part Number: MMBT5551-7-F; Manufacture  Cross: Diodes Incorporated; ComponentLink1Description: Link Datasheet; ComponentLink1URL: https://www.diodes.com/assets/Datasheets/MMBT5551.pdf; ComponentLink2Description: Link Cross; ComponentLink2URL: https://www.mouser.vn/ProductDetail/Diodes-Incorporated/MMBT5551-7-F?qs=CHt8fYyHClyETH%252BLCSkJww%3D%3D&utm_id=10891671065&gad_source=1&gclid=CjwKCAjwodC2BhAHEiwAE67hJPGyqeHyYlR3S-t7hko_jWt_nOpxhcIyAb8SVIa0-jKBu2OPq0NVERoC2hsQAvD_BwE; ComponentLink3Description: Link Original; ComponentLink3URL: https://www.digikey.com/en/products/detail/diodes-incorporated/MMBT5551-7-F/1154713; Link: https://www.digikey.com/en/products/detail/diodes-incorporated/MMBT5551-7-F/1154713; Package: SOT-23-3; Price: 0.034 USD
R1 = RES;SMD;1.5kR 1/8W 1%; 0805;: RES;SMD;1.5kR; 1%; 0805;Thick Film Resistors - SMD 1/8watt 1.5Kohms 1%; Manufacturer Part Number: CRCW08051K50FKEA; Manufacturer: Vishay / Dale; Manufacture Part Number Cross: ESR10EZPF1501; Manufacture Cross: ROHM Semiconductor; Library Make By: Minh Reus; Link: https://www.mouser.vn/ProductDetail/Vishay-Dale/CRCW08051K50FKEA?qs=DZvKvnD5UYVo4ieimONp3Q%3D%3D; Package: 0805; Value: 1.5kR 1/8W 1%; Price: 0.0096 USD; ComponentLink1Description: Link Cross; ComponentLink1URL: https://www.mouser.dk/ProductDetail/ROHM-Semiconductor/ESR10EZPF1501?qs=sGAEpiMZZMvdGkrng054t4QdAY%2FQ0LweXCbazTcGBR4%3D; ComponentLink2Description: Link Original; ComponentLink2URL: https://www.mouser.vn/ProductDetail/Vishay-Dale/CRCW08051K50FKEA?qs=DZvKvnD5UYVo4ieimONp3Q%3D%3D; ComponentLink3Description: Link Datasheet; ComponentLink3URL: https://www.mouser.dk/datasheet/2/348/ROHM_S_A0011075102_1-2563252.pdf
R2 R6 R8 R11 R12 R15 R16 = RES;SMD;1kR ±1% 125mW;0805: SMD Chip Resistor, 1 kOhm, ± 1%, 125 mW, 0805 [2012 Metric], Thick Film, General Purpose; Manufacturer: Yageo; Manufacturer Part Number: RC0805FR-071KL; Manufacture Cross: Panasonic; Manufacture Part Number Cross: ERJ-U06F1001V; Library Make By: Minh Reus; Package: 0805; Value: 1kR ±1% 125mW; Link: https://www.digikey.com/en/products/detail/yageo/RC0805FR-071KL/727444; Price: 0.026 USD; ComponentLink1Description: Link Datasheet; ComponentLink1URL: https://www.mouser.com/datasheet/2/315/AOA0000C334-1314047.pdf; ComponentLink2Description: Link Cross; ComponentLink2URL: https://www.mouser.com/ProductDetail/Panasonic/ERJ-U06F1001V?qs=Yyy8avaXlIuMmWm2vlSlCQ%3D%3D; ComponentLink3Description: Link Original; ComponentLink3URL: https://www.digikey.com/en/products/detail/yageo/RC0805FR-071KL/727444
R3 = RES;SMD;4.7kR 0.1% 125mW ;0805;: RES;SMD;4.7kR 0.1%;0805; / 125mW Thick Film Resistors 150V ±100ppm/℃ ±1% 4.7kΩ 0805 Chip Resistor - Surface Mount ROHS; Manufacturer: UNI-ROYAL(Uniroyal Elec); Manufacturer Part Number: 0805W8F4701T5E; Manufacture Cross: Royalohm; Library Make By: Minh Reus; Link: https://www.lcsc.com/product-detail/Chip-Resistor-Surface-Mount-UniOhm_4-7KR-4701-1_C17673.html; Package: 0805; Value: 4.7kR 1% 125mW; Manufacture Part Number Cross: 0805W8F4701T5E; Price: 0.002 USD; ComponentLink1Description: Link Datasheet; ComponentLink1URL: https://www.mouser.vn/datasheet/2/1365/1-3044649.pdf; ComponentLink2Description: Link Original; ComponentLink2URL: https://www.lcsc.com/product-detail/Chip-Resistor-Surface-Mount-UniOhm_4-7KR-4701-1_C17673.html; ComponentLink3Description: Link Cross; ComponentLink3URL: https://www.mouser.in/ProductDetail/Royalohm/0805W8F4701T5E?qs=e8oIoAS2J1RsbupGwbBZOQ%3D%3D
R7 R9 R10 R17 = RES;SMD;10kR ±1% 125mW;0805: SMD Chip Resistor, 10 kOhm, ± 1%, 125 mW, 0805 [2012 Metric], Thick Film, General Purpose; Manufacturer: Yageo; Manufacturer Part Number: RC0805FR-0710KL; Manufacture Cross: Panasonic; Manufacture Part Number Cross: ERA-6AED103V; Library Make By: Minh Reus; Price: 0.0021 USD; Package: 0805; Value: 10kR ±1% 125mW; Link: https://www.digikey.com/en/products/detail/yageo/RC0805FR-0710KL/727535; ComponentLink1Description: Link Datasheet; ComponentLink1URL: https://www.yageo.com/upload/media/product/products/datasheet/rchip/PYu-RC_Group_51_RoHS_L_12.pdf; ComponentLink2Description: Link Cross; ComponentLink2URL: https://www.mouser.vn/ProductDetail/Panasonic/ERA-6AED103V?qs=sGAEpiMZZMvdGkrng054t%252B2w5OgPkZzP3H4OQ%252B%2FzOTo%3D; ComponentLink3Description: Link Original; ComponentLink3URL: https://www.digikey.com/en/products/detail/yageo/RC0805FR-0710KL/727535
READY = LED_SINGE_DIP, 3mm, GREEN: LED, PCB, Green, 0.63mcd, 3mm, T-1, 7mA, 1.9V, 565nm, 25deg, 20V, 20mW, -40 | Vishay / Small Signal & Opto Products (SSP) TLLG4400; Link: https://www.mouser.com/ProductDetail/Vishay-Semiconductors/TLLG4400?qs=%2Fjqivxn91cerqNQZQL5RLQ%3D%3D; Package: Radial Vishay Semiconductor; Manufacturer: Vishay; Manufacturer Part Number: TLLG4400; Check_prices: https://www.snapeda.com/parts/TLLG4400/Vishay/view-part/?ref=eda
RELAY = RELAY 16A;DIP: 277V@AC 12V 16A One Normally Open: 1A (SPST-NO) Plugin,10.2x18.4mm Power Relays ROHS; Manufacturer: HONGFA  RELAY; Manufacturer Part Number: HF32FV-16; Link: https://jlcpcb.com/partdetail/3385059-HF32FV_G_5_HSTF_590/C2976839?gad_source=1&gclid=CjwKCAjwrvyxBhAbEiwAEg_Kggzsubv7LJyZKWdZUmnJDDktjCoFIZy7Wb7OQvN8qh-PhAayUkFcnxoCm90QAvD_BwE; Package: DIP; Values: 16A; ComponentLink1Description: New link; ComponentLink1URL: *; ComponentLink2Description: New link; ComponentLink2URL: *; ComponentLink3Description: New link; ComponentLink3URL: *; Price: 0.46 USD; Manufacture Cross: HONGFA  RELAY; Manufacture Part Number Cross: HF32FV-16
S1-S4 = SWITCH 4 PIN;TH;: SWITCH TACTILE SPST-NO 0.05A 12V / Tactile Switch SPST-NO Top Actuated Surface Mount; Manufacturer Part Number: TS04-66-95-BK-100-SMT; Manufacturer: Same Sky; Value: NA; Library Make By: Minh Reus; Package: SMD; Link: https://www.digikey.com/en/products/detail/same-sky-formerly-cui-devices/TS04-66-95-BK-100-SMT/15634366; Manufacture Cross: Same Sky; Manufacture Part Number Cross: TS04-66-95-BK-100-SMT; Price: 0.09 USD; ComponentLink1Description: Link Datasheet; ComponentLink1URL: https://www.sameskydevices.com/product/resource/ts04.pdf; ComponentLink2Description: Link Cross; ComponentLink2URL: https://www.digikey.com/en/products/detail/same-sky-formerly-cui-devices/TS04-66-95-BK-100-SMT/15634366; ComponentLink3Description: Link Digikey; ComponentLink3URL: https://www.digikey.com/en/products/detail/same-sky-formerly-cui-devices/TS04-66-95-BK-100-SMT/15634366
T1 = PCB_TRANSFORMER;6P TH;: Máy Biến Áp Fullstar EI30; Value: NA; Library Make By: Minh Reus; Manufacturer: FULLSTAR; Link: https://chima.vn/products/may-bien-ap-fullstar-ei30; Manufacture Cross: FULLSTAR; Manufacture Part Number Cross: FE3012004; Package: TH; Price: 0.28 USD; ComponentLink1Description: Link Datasheet; ComponentLink1URL: https://ko.x-fullstartech.com/Content/upload/2019497916/PDF/FE3012-1-5-1-8.pdf; ComponentLink2Description: Link Cross; ComponentLink2URL: https://chima.vn/products/may-bien-ap-fullstar-ei30; ComponentLink3Description: Link Original; ComponentLink3URL: https://chima.vn/products/may-bien-ap-fullstar-ei30
U1 = IC_LDO;SMD;7805;TO263: Linear Voltage Regulator IC Positive Fixed 1 Output 1.5A D2PAK; Manufacture Cross: STMicroelectronics; Package: TO-263; Value: VOUT = 5V; Manufacturer Part Mumber: 7805CD2T; Price: 0.341 USD; Link: https://www.mouser.com/ProductDetail/STMicroelectronics/L7805CD2T-TR?qs=8tkG3v2%2F4sGtQPO74MZjHw%3D%3D&srsltid=AfmBOoqJ1_rPUJKQ9obsiREj1kvNfFD9iVB_kLYdaJq-gs2EOPFy-M9J; Manufacturer: STMicroelectronics
U2 = MCU_LED-DRIVER;BS86D12C;28-SOP: IC;MCU,BS86D12C; Manufacturer Part Number: Holtek Semiconductor; Value: VCC =5V; Price: Non-available; Manufacturer: BS86D12C; Package: SOP-28; Manufacture Part Number 1: Holtek Semiconductor; Link: https://www.dasenic.com/product/details/holtek-bs86d12c-8285152; ComponentLink1Description: Link Cross; ComponentLink1URL: https://www.dasenic.com/product/details/holtek-bs86d12c-8285152; ComponentLink2Description: Link Datasheet; ComponentLink2URL: https://www.dasenic.com/product/details/holtek-bs86d12c-8285152; ComponentLink3Description: Link Original; ComponentLink3URL: https://www.dasenic.com/product/details/holtek-bs86d12c-8285152
U3 = MCU_ESP32-WROOM-32UE;SMD: Bluetooth, WiFi 802.11b/g/n, Bluetooth v4.2 +EDR, Class 1, 2 and 3 Transceiver Module 2.4GHz ~ 2.5GHz Antenna Not Included, U.FL Surface Mount; Manufacturer: Espressif Systems; Manufacture Part Number Cross: ESP32-WROOM-32UE(M113EH6400UH3Q0); Value: VCC = 3.3V; Package: SMD; Link: https://www.mouser.vn/ProductDetail/Espressif-Systems/ESP32-WROOM-32UE-N8?qs=Li%252BoUPsLEntX6CSaKZB9vw%3D%3D&srsltid=AfmBOopeFFRWVh4BzmU-0mSC1R78KZGcgo6rCRG5seF36Dyfr6afST2m; Manufacture Cross: Espressif Systems; Price: 2.08 USD; ComponentLink1Description: Link Cross; ComponentLink1URL: https://www.mouser.vn/ProductDetail/Espressif-Systems/ESP32-WROOM-32UE-N8?qs=Li%252BoUPsLEntX6CSaKZB9vw%3D%3D&srsltid=AfmBOopeFFRWVh4BzmU-0mSC1R78KZGcgo6rCRG5seF36Dyfr6afST2m; ComponentLink2Description: Link Datasheet; ComponentLink2URL: https://www.mouser.vn/ProductDetail/Espressif-Systems/ESP32-WROOM-32UE-N8?qs=Li%252BoUPsLEntX6CSaKZB9vw%3D%3D&srsltid=AfmBOopeFFRWVh4BzmU-0mSC1R78KZGcgo6rCRG5seF36Dyfr6afST2m; ComponentLink3Description: Link Original; ComponentLink3URL: https://www.mouser.vn/ProductDetail/Espressif-Systems/ESP32-WROOM-32UE-N8?qs=Li%252BoUPsLEntX6CSaKZB9vw%3D%3D&srsltid=AfmBOopeFFRWVh4BzmU-0mSC1R78KZGcgo6rCRG5seF36Dyfr6afST2m
U4 = IC LDO;SMD;: IC LDO;SMD;AMS1117-3.3;Sot223/Pkg 1-Amp 3.3-Volt Low Drop Out Voltage Regulatator; Manufacturer: Advanced Monolithic Systems; Value: NA; Library Make By: Minh Reus; Package: SOT-223 Seeed Technology; Link: https://jlcpcb.com/partdetail/Advanced_MonolithicSystems-AMS1117_33/C6186?gad_source=1&gclid=Cj0KCQjwxqayBhDFARIsAANWRnR2VvdQbR5Ot5dS4CieXV_DfIoCNotI4JZ7Mvprgi_EPa34v77PiaMaAvuxEALw_wcB; Manufacture Cross: Advanced Monolithic Systems; Manufacture Part Number Cross: AMS1117-3.3; Price: 0.1305 USD; ComponentLink1Description: Link Original; ComponentLink1URL: https://jlcpcb.com/partdetail/Advanced_MonolithicSystems-AMS1117_33/C6186?gad_source=1&gclid=Cj0KCQjwxqayBhDFARIsAANWRnR2VvdQbR5Ot5dS4CieXV_DfIoCNotI4JZ7Mvprgi_EPa34v77PiaMaAvuxEALw_wcB; ComponentLink2Description: Link Cross; ComponentLink2URL: https://jlcpcb.com/partdetail/Advanced_MonolithicSystems-AMS1117_33/C6186?gad_source=1&gclid=Cj0KCQjwxqayBhDFARIsAANWRnR2VvdQbR5Ot5dS4CieXV_DfIoCNotI4JZ7Mvprgi_EPa34v77PiaMaAvuxEALw_wcB; ComponentLink3Description: Link Datasheet; ComponentLink3URL: https://jlcpcb.com/partdetail/Advanced_MonolithicSystems-AMS1117_33/C6186?gad_source=1&gclid=Cj0KCQjwxqayBhDFARIsAANWRnR2VvdQbR5Ot5dS4CieXV_DfIoCNotI4JZ7Mvprgi_EPa34v77PiaMaAvuxEALw_wcB